# EAGLE design Finishline Controller (EAGLE 7.7.0)
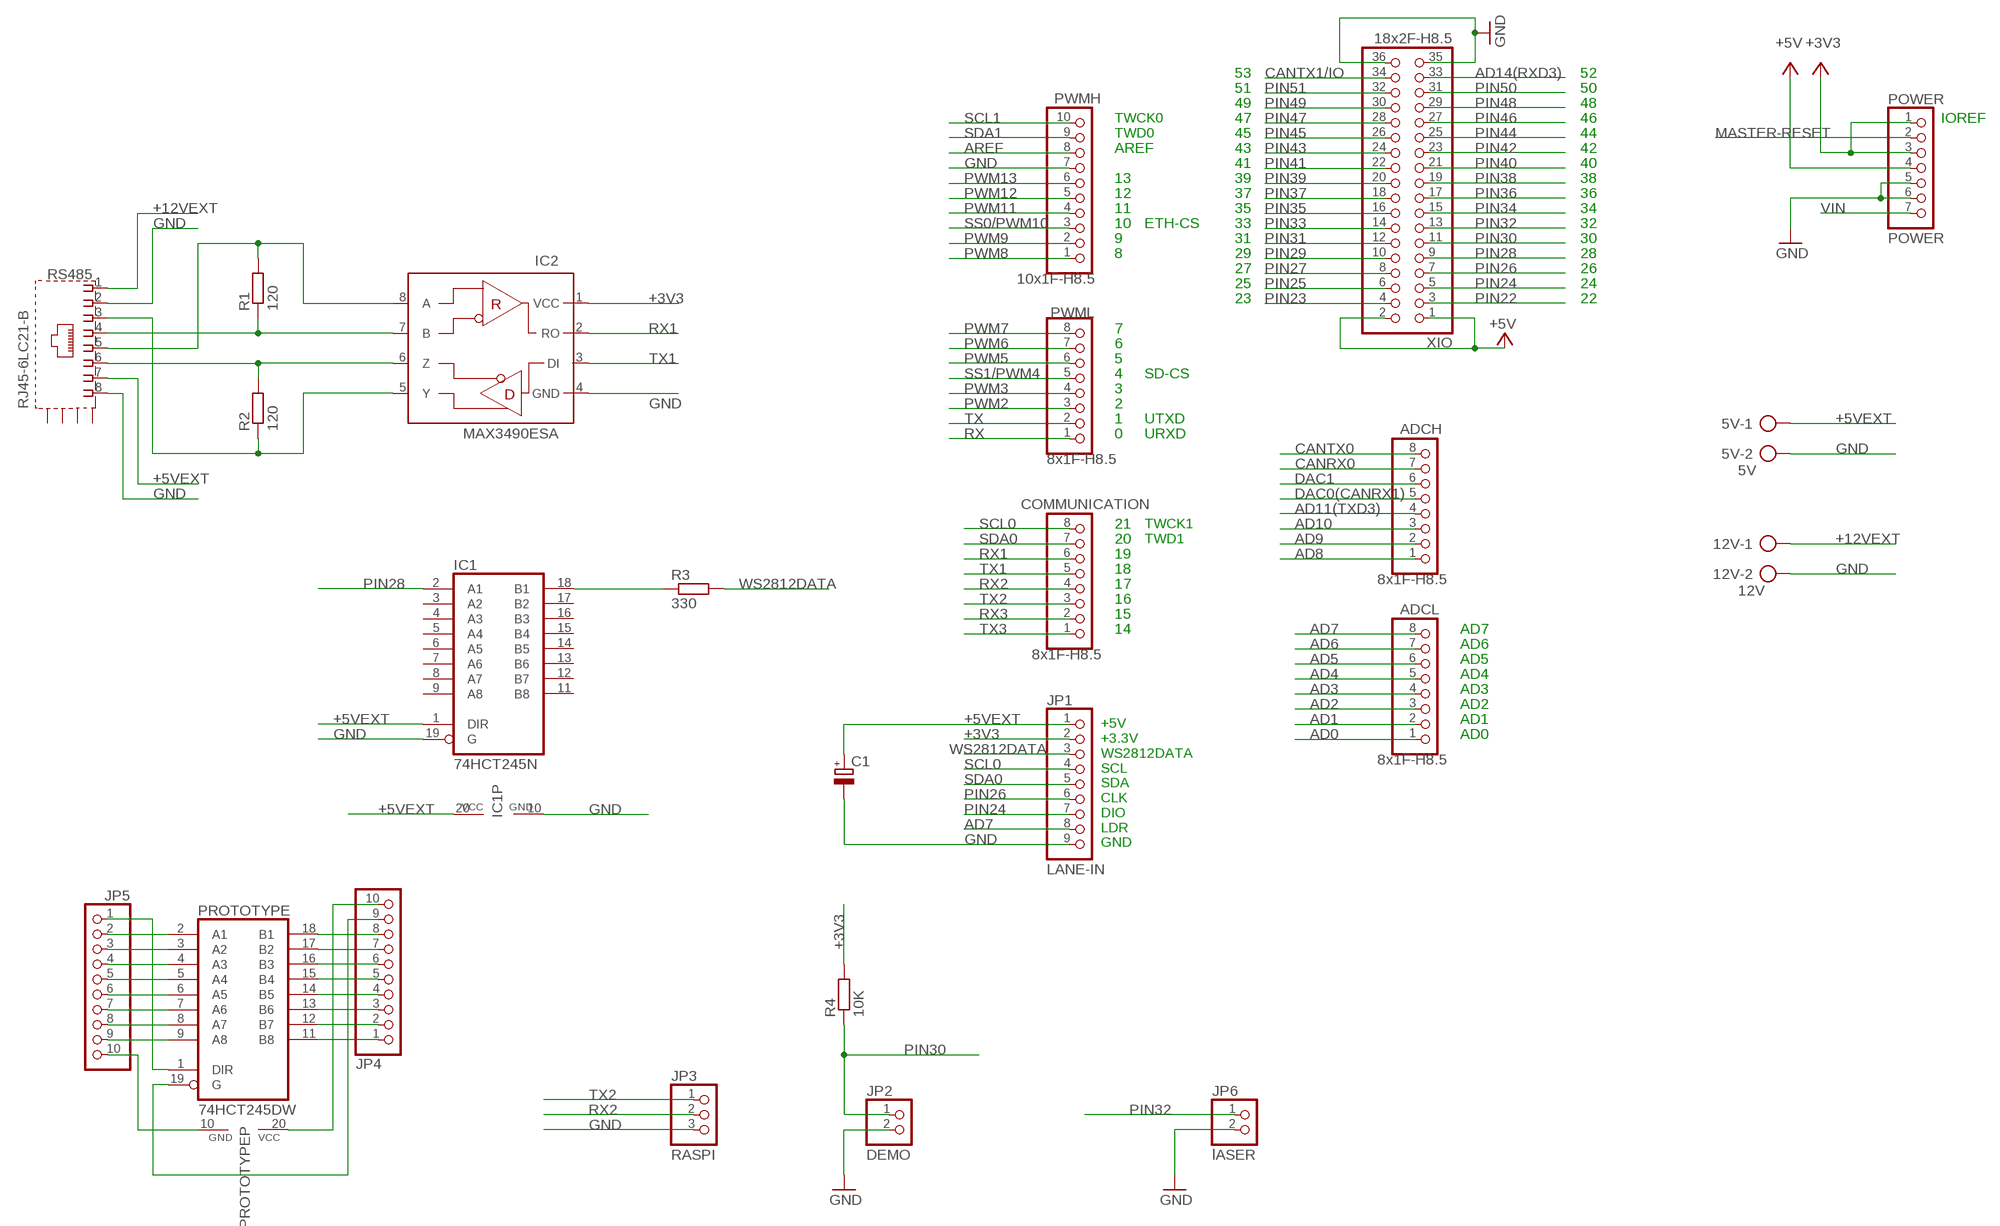
[diagram p0: schematic, sheet 1]

## Parts
5V  5V  AK300/2  [AK300/2]
12V  12V  AK300/2  [AK300/2]
ADCH  8x1F-H8.5  PINHD-1X8  [1X08]
ADCL  8x1F-H8.5  PINHD-1X8  [1X08]
C1  CPOL-EUE5-10.5  [E5-10,5]
COMMUNICATION  8x1F-H8.5  PINHD-1X8  [1X08]
IC1  74HCT245N  [DIL20]
IC2  MAX3490ESA  [SO08]
JP1  LANE-IN  PINHD-1X9  [1X09]
JP2  DEMO  PINHD-1X2  [1X02]
JP3  RASPI  PINHD-1X3  [1X03]
JP4  PINHD-1X10  [1X10]
JP5  PINHD-1X10  [1X10]
JP6  lASER  PINHD-1X2  [1X02]
POWER  POWER  PINHD-1X7  [1X07]
PROTOTYPE  74HCT245DW  [SO20W]
PWMH  10x1F-H8.5  PINHD-1X10  [1X10]
PWML  8x1F-H8.5  PINHD-1X8  [1X08]
R1  120  R-EU_R0805  [R0805]
R2  120  R-EU_R0805  [R0805]
R3  330  R-EU_R0805  [R0805]
R4  10K  R-EU_R0805  [R0805]
RS485  RJ45-6LC21-B  [RJ45-SHIELD1]
XIO  18x2F-H8.5  PINHD-2X18  [2X18]

## Nets
+3V3: IC2.1(VCC) JP1.2 POWER.1 POWER.3 R4.2
+5V: POWER.4 XIO.1 XIO.2
+5VEXT: 5V.1 C1.+ IC1.1(DIR) IC1.20(VCC) JP1.1 RS485.7
+12VEXT [12V]: 12V.1 RS485.1
AD0: ADCL.1
AD1: ADCL.2
AD2: ADCL.3
AD3: ADCL.4
AD4: ADCL.5
AD5: ADCL.6
AD6: ADCL.7
AD7: ADCL.8 JP1.8
AD8: ADCH.1
AD9: ADCH.2
AD10: ADCH.3
AD11(TXD3): ADCH.4
AD14(RXD3): XIO.33
AREF: PWMH.8
CANRX0: ADCH.7
CANTX0: ADCH.8
CANTX1/IO: XIO.34
DAC0(CANRX1): ADCH.5
DAC1: ADCH.6
GND: 5V.2 12V.2 C1.- IC1.10(GND) IC1.19(G) IC2.4(GND) JP1.9 JP2.2 JP3.3 JP6.2 POWER.5 POWER.6 PWMH.7 RS485.2 RS485.8 XIO.35 XIO.36
MASTER-RESET: POWER.2
N$2: IC1.18(B1) R3.1
N$3: IC2.7(B) R1.1 RS485.4
N$4: IC2.6(Z) R2.2 RS485.6
N$5: IC2.5(Y) R2.1 RS485.3
N$6: IC2.8(A) R1.2 RS485.5
N$79: JP5.2 PROTOTYPE.2(A1)
N$80: JP5.3 PROTOTYPE.3(A2)
N$81: JP5.4 PROTOTYPE.4(A3)
N$82: JP5.5 PROTOTYPE.5(A4)
N$83: JP5.6 PROTOTYPE.6(A5)
N$84: JP5.7 PROTOTYPE.7(A6)
N$85: JP5.8 PROTOTYPE.8(A7)
N$86: JP5.9 PROTOTYPE.9(A8)
N$87: JP5.10 PROTOTYPE.10(GND)
N$88: JP5.1 PROTOTYPE.1(DIR)
N$89: JP4.8 PROTOTYPE.18(B1)
N$90: JP4.7 PROTOTYPE.17(B2)
N$91: JP4.6 PROTOTYPE.16(B3)
N$92: JP4.5 PROTOTYPE.15(B4)
N$93: JP4.4 PROTOTYPE.14(B5)
N$94: JP4.3 PROTOTYPE.13(B6)
N$95: JP4.2 PROTOTYPE.12(B7)
N$96: JP4.1 PROTOTYPE.11(B8)
N$97: JP4.9 PROTOTYPE.19(G)
N$98: JP4.10 PROTOTYPE.20(VCC)
PIN22: XIO.3
PIN23: XIO.4
PIN24: JP1.7 XIO.5
PIN25: XIO.6
PIN26: JP1.6 XIO.7
PIN27: XIO.8
PIN28: IC1.2(A1) XIO.9
PIN29: XIO.10
PIN30: JP2.1 R4.1 XIO.11
PIN31: XIO.12
PIN32: JP6.1 XIO.13
PIN33: XIO.14
PIN34: XIO.15
PIN35: XIO.16
PIN36: XIO.17
PIN37: XIO.18
PIN38: XIO.19
PIN39: XIO.20
PIN40: XIO.21
PIN41: XIO.22
PIN42: XIO.23
PIN43: XIO.24
PIN44: XIO.25
PIN45: XIO.26
PIN46: XIO.27
PIN47: XIO.28
PIN48: XIO.29
PIN49: XIO.30
PIN50: XIO.31
PIN51: XIO.32
PWM2: PWML.3
PWM3: PWML.4
PWM5: PWML.6
PWM6: PWML.7
PWM7: PWML.8
PWM8: PWMH.1
PWM9: PWMH.2
PWM11: PWMH.4
PWM12: PWMH.5
PWM13: PWMH.6
RX: PWML.1
RX1: COMMUNICATION.6 IC2.2(RO)
RX2: COMMUNICATION.4 JP3.2
RX3: COMMUNICATION.2
SCL0: COMMUNICATION.8 JP1.4
SCL1: PWMH.10
SDA0: COMMUNICATION.7 JP1.5
SDA1: PWMH.9
SS0/PWM10: PWMH.3
SS1/PWM4: PWML.5
TX: PWML.2
TX1: COMMUNICATION.5 IC2.3(DI)
TX2: COMMUNICATION.3 JP3.1
TX3: COMMUNICATION.1
VIN: POWER.7
WS2812DATA: JP1.3 R3.2
Unconnected: IC1.3(A2) IC1.4(A3) IC1.5(A4) IC1.6(A5) IC1.7(A6) IC1.8(A7) IC1.9(A8) IC1.11(B8) IC1.12(B7) IC1.13(B6) IC1.14(B5) IC1.15(B4) IC1.16(B3) IC1.17(B2) RS485.S1(S) RS485.S2(S) RS485.S3(S) RS485.S4(S)

## Notes on the sheet
- 53 | 52
- 51 | 50
- 49 | 48
- TWCK0 | 47 | 46 | IOREF
- TWD0 | 45 | 44
- AREF | 43 | 42
- 41 | 40
- 13 | 39 | 38
- 12 | 37 | 36
- 11 | 35 | 34
- 10 | ETH-CS | 33 | 32
- 9 | 31 | 30
- 8 | 29 | 28
- 27 | 26
- 25 | 24
- 23 | 22
- 7
- 6
- 5
- 4 | SD-CS
- 3
- 2
- 1 | UTXD
- 0 | URXD
- 21 | TWCK1
- 20 | TWD1
- 19
- 18
- 17
- 16
- 15
- 14 | AD7
- AD6
- AD5
- AD4
- AD3
- AD2
- AD1
- AD0
- +5V
  +3.3V
  WS2812DATA
  SCL
  SDA
  CLK
  DIO
  LDR
  GND

## Library data of the parts
5V 12V = con-ptr500:AK300/2: CONNECTOR; OC_FARNELL: unknown; OC_NEWARK: unknown
ADCH ADCL COMMUNICATION PWML = SmartPrj:PINHD-1X8: PIN HEADER
C1 = resistor:CPOL-EU: POLARIZED CAPACITOR, European symbol
IC1 PROTOTYPE = 74xx-eu:74*245: Octal BUS TRANSCEIVER, 3-state
IC2 = miro:MAX3490: +3.3V 10Mbps, RS-485 Transceivers
JP1 = pinhead:PINHD-1X9: PIN HEADER
JP2 JP6 = pinhead:PINHD-1X2: PIN HEADER
JP3 = pinhead:PINHD-1X3: PIN HEADER
JP4 JP5 = pinhead:PINHD-1X10: PIN HEADER
POWER = pinhead:PINHD-1X7: PIN HEADER
PWMH = SmartPrj:PINHD-1X10: PIN HEADER
R1-R4 = resistor:R-EU_: RESISTOR, European symbol
RS485 = con-tycoelectronics:RJ45*2: RJ45 Low Profile Shield Type 2 For all RJ45 L, LC, LCT and X Series Models Source: www.tycoelectronics.com .. ENG_DS_1654001_1099_RJ_L_0507.pdf; OC_FARNELL: unknown; OC_NEWARK: unknown
XIO = SmartPrj:PINHD-2X18: PIN HEADER

## Net classes
1 USB: width 0.203 mm, drill 0.406 mm, clearance 0.203 mm
2 gnd: width 0.203 mm, drill 0.406 mm, clearance 0.203 mm
3 usbvcc: width 0.203 mm, drill 0.406 mm, clearance 0.203 mm
4 USBpair: width 0.254 mm, drill 0.406 mm, clearance 0.61 mm
5 12V: width 0.305 mm, drill 0.406 mm, clearance 0.61 mm

## Board
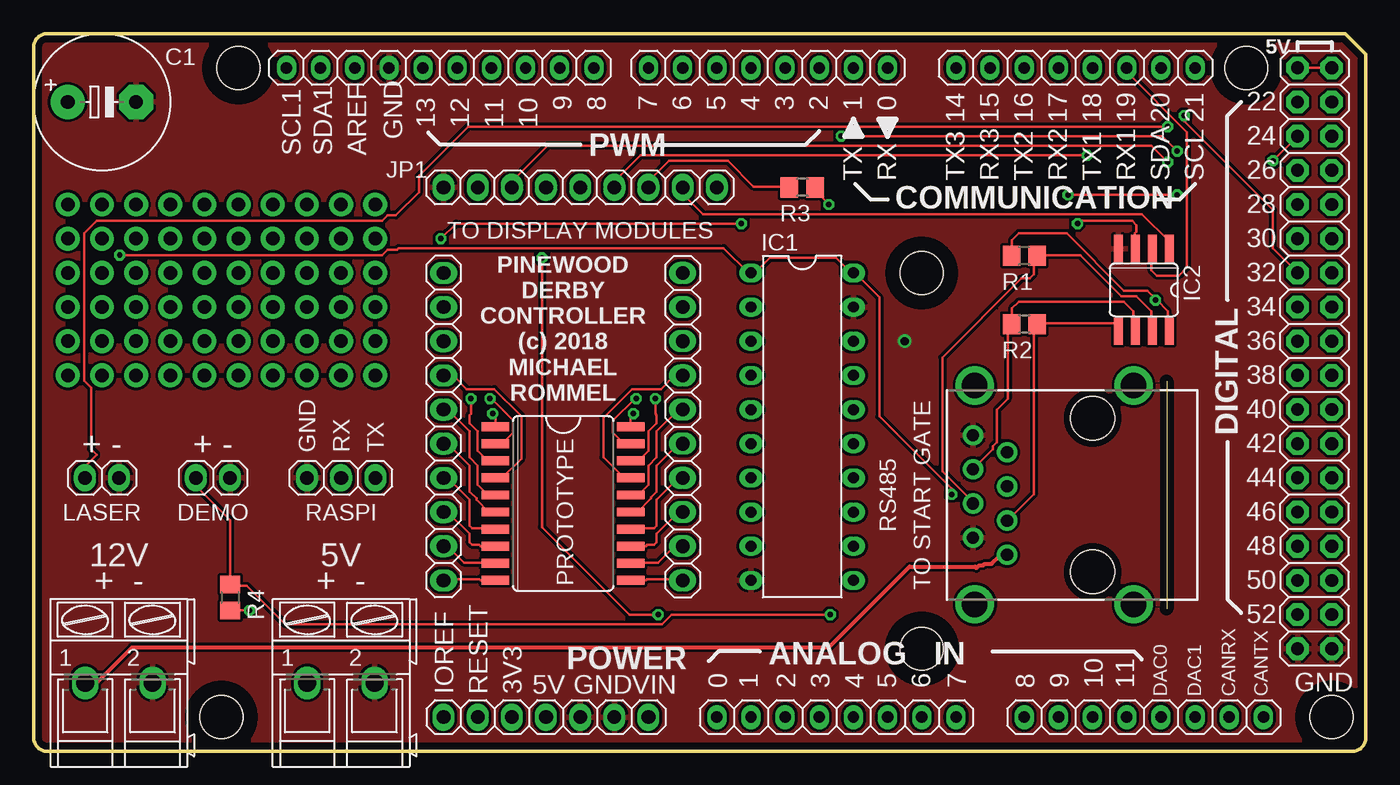
[diagram p1: board, top side]
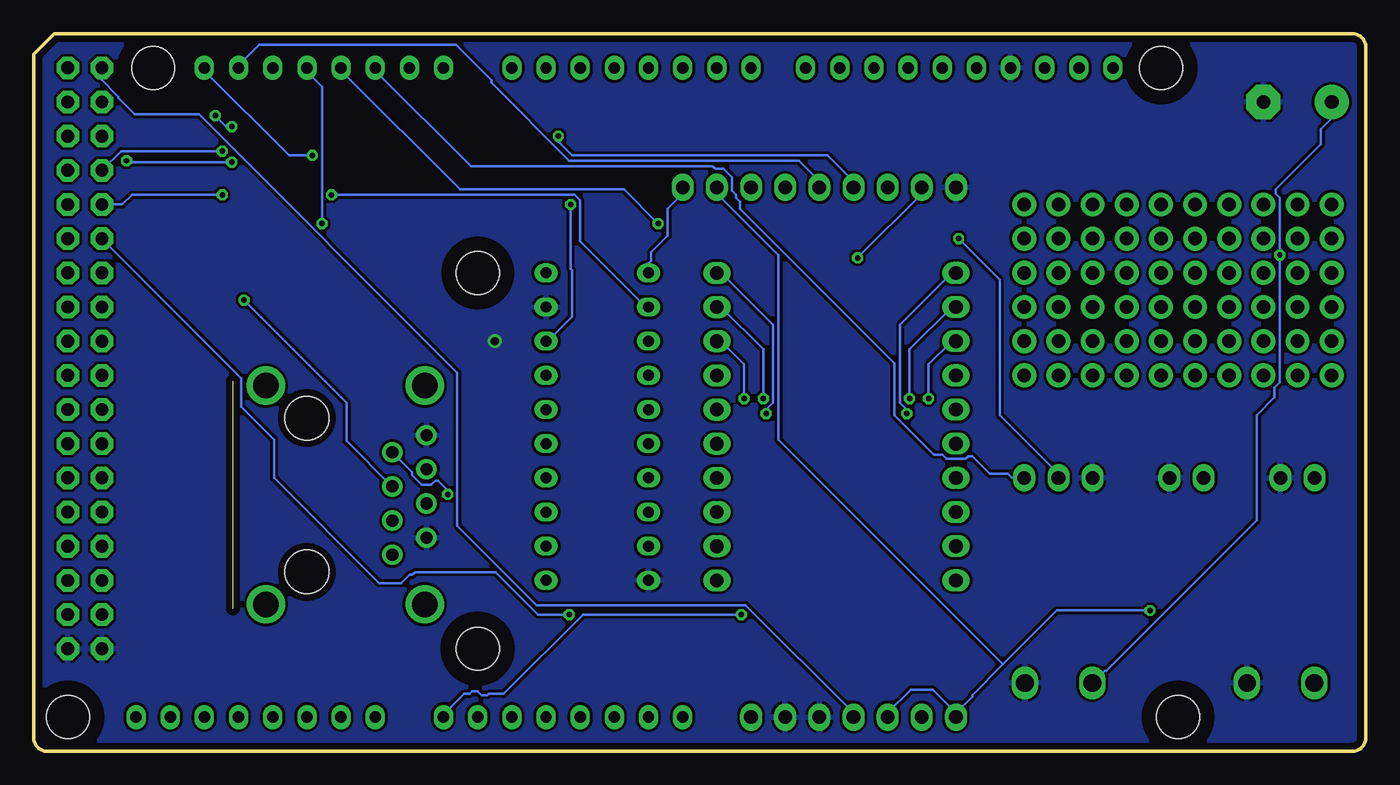
[diagram p2: board, bottom side, seen from below]

Size 99.06 x 53.34 mm. Coordinates in mm from the lower left corner, seen from the top.
Outline: 97.54,53.34 99.06,51.82 99.06,1 arc-90 98.06,0 1,0 arc-90 0,1 0,52.34 arc-90 1,53.34 97.54,53.34
Copper layers (1*16): Top 0.035mm / dielectric 1.6mm / Bottom 0.035mm
Design rules "default *": minimum track width 8mil, minimum drill 16mil, track to track 8mil, track to pad 8mil, pad to pad 8mil, via to via 8mil, smd to smd 6mil, copper to edge 20mil, drill to drill 12mil, minimum pad ring 12mil, minimum via ring 8mil, stop-mask expansion 2mil, vias tented up to drill 25mil, thermal gap 8mil
Holes 3.2 mm at 96.52,2.54 15.24,50.8 90.17,50.8 13.97,2.54 66.04,35.56 66.04,7.62
tRestrict: area 63.5,5.1 to 68.6,10.2; area 12.7,48.3 to 17.8,53.3; area 63.5,33 to 68.6,38.1; area 87.6,48.3 to 92.7,53.3; area 94,0 to 99.1,5.1; area 11.4,0 to 16.5,5.1
bRestrict: area 63.5,5.1 to 68.6,10.2; area 12.7,48.3 to 17.8,53.3; area 63.5,33 to 68.6,38.1; area 87.6,48.3 to 92.7,53.3; area 94,0 to 99.1,5.1; area 11.4,0 to 16.5,5.1

### Footprints (pad centres in the part's own frame; a part is rotated, then mirrored left to right if it is on the bottom)
AK300/2 = drill 1.321 long: 1 -2.515,0; 2 2.489,0
1X08 = drill 0.85 pad 1.422 long: 1 -8.89,0; 2 -6.35,0; 3 -3.81,0; 4 -1.27,0; 5 1.27,0; 6 3.81,0; 7 6.35,0; 8 8.89,0
E5-10,5 = drill 1.016 pad 2.54: + -2.54,0 | drill 1.016 pad 2.54 octagon: - 2.54,0
DIL20 = drill 0.813 long: 1 -11.43,-3.81; 2 -8.89,-3.81; 3 -6.35,-3.81; 4 -3.81,-3.81; 5 -1.27,-3.81; 6 1.27,-3.81; 7 3.81,-3.81; 8 6.35,-3.81; 9 8.89,-3.81; 10 11.43,-3.81; 11 11.43,3.81; 12 8.89,3.81; 13 6.35,3.81; 14 3.81,3.81; 15 1.27,3.81; 16 -1.27,3.81; 17 -3.81,3.81; 18 -6.35,3.81; 19 -8.89,3.81; 20 -11.43,3.81
SO08 = smd 0.66 x 2.032: 1 -1.905,-3.073; 2 -0.635,-3.073; 3 0.635,-3.073; 4 1.905,-3.073; 5 1.905,3.073; 6 0.635,3.073; 7 -0.635,3.073; 8 -1.905,3.073
1X09 = drill 1.016 long: 1 -10.16,0; 2 -7.62,0; 3 -5.08,0; 4 -2.54,0; 5 0,0; 6 2.54,0; 7 5.08,0; 8 7.62,0; 9 10.16,0
1X02 = drill 1.016 long: 1 -1.27,0; 2 1.27,0
1X03 = drill 1.016 long: 1 -2.54,0; 2 0,0; 3 2.54,0
1X10 = drill 1.016 long: 1 -11.43,0; 2 -8.89,0; 3 -6.35,0; 4 -3.81,0; 5 -1.27,0; 6 1.27,0; 7 3.81,0; 8 6.35,0; 9 8.89,0; 10 11.43,0
1X07 = drill 1.016 long: 1 -7.62,0; 2 -5.08,0; 3 -2.54,0; 4 0,0; 5 2.54,0; 6 5.08,0; 7 7.62,0
SO20W = smd 0.66 x 2.032: 1 -5.715,-5.029; 2 -4.445,-5.029; 3 -3.175,-5.029; 4 -1.905,-5.029; 5 -0.635,-5.029; 6 0.635,-5.029; 7 1.905,-5.029; 8 3.175,-5.029; 9 4.445,-5.029; 10 5.715,-5.029; 11 5.715,5.029; 12 4.445,5.029; 13 3.175,5.029; 14 1.905,5.029; 15 0.635,5.029; 16 -0.635,5.029; 17 -1.905,5.029; 18 -3.175,5.029; 19 -4.445,5.029; 20 -5.715,5.029
1X10' = drill 0.85 pad 1.422 long: 1 -11.43,0; 2 -8.89,0; 3 -6.35,0; 4 -3.81,0; 5 -1.27,0; 6 1.27,0; 7 3.81,0; 8 6.35,0; 9 8.89,0; 10 11.43,0
R0805 = smd 1.3 x 1.5: 1 -0.95,0; 2 0.95,0
RJ45-SHIELD1 = drill 0.9 pad 1.4: 1 -4.445,6.35; 2 -3.175,8.89; 3 -1.905,6.35; 4 -0.635,8.89; 5 0.635,6.35; 6 1.905,8.89; 7 3.175,6.35; 8 4.445,8.89 | drill 1.9 pad 2.5: S1 -8.128,-3.048; S2 8.128,-3.048; S3 -8.128,8.76; S4 8.128,8.76 | hole 3.251: -5.715,0; 5.715,0
2X18 = drill 0.95 pad 1.676 octagon: 1 -21.59,-1.27; 2 -21.59,1.27; 3 -19.05,-1.27; 4 -19.05,1.27; 5 -16.51,-1.27; 6 -16.51,1.27; 7 -13.97,-1.27; 8 -13.97,1.27; 9 -11.43,-1.27; 10 -11.43,1.27; 11 -8.89,-1.27; 12 -8.89,1.27; 13 -6.35,-1.27; 14 -6.35,1.27; 15 -3.81,-1.27; 16 -3.81,1.27; 17 -1.27,-1.27; 18 -1.27,1.27; 19 1.27,-1.27; 20 1.27,1.27; 21 3.81,-1.27; 22 3.81,1.27; 23 6.35,-1.27; 24 6.35,1.27; 25 8.89,-1.27; 26 8.89,1.27; 27 11.43,-1.27; 28 11.43,1.27; 29 13.97,-1.27; 30 13.97,1.27; 31 16.51,-1.27; 32 16.51,1.27; 33 19.05,-1.27; 34 19.05,1.27; 35 21.59,-1.27; 36 21.59,1.27

### Placement (x,y rotation side)
5V  22.86,5.08 0 top
12V  6.35,5.08 0 top
ADCH  82.55,2.54 0 top
ADCL  59.69,2.54 0 top
C1  5.08,48.26 0 top
COMMUNICATION  77.47,50.8 0 top
IC1  57.15,24.13 270 top
IC2  82.55,34.29 180 top
JP1  40.64,41.91 180 top
JP2  13.34,20.32 0 top
JP3  22.86,20.32 180 top
JP4  48.26,24.13 90 top
JP5  30.48,24.13 270 top
JP6  5.08,20.32 0 top
POWER  38.1,2.54 0 top
PROTOTYPE  39.37,18.41 270 top
PWMH  10x1F-H8.5  [1X10']  30.23,50.8 180 top
PWML  54.61,50.8 180 top
R1  73.66,36.83 180 top
R2  73.66,31.75 180 top
R3  57.15,41.91 180 top
R4  14.61,11.43 270 top
RS485  78.74,19.05 90 top
XIO  95.25,29.21 270 top

### Tracks (layer width: path | path; a pad name or v marks a point on that pad's centre or on a via)
+3V3  (via drill 0.41)
  Top 0.203: v16.05,10.46 14.63,10.46 R4.2 | JP1.2 48.26,41.45 49.78,39.93 82.4,39.93 84.43,37.9 84.43,37.39 IC2.1
  Bottom 0.203: v16.05,10.46 22.96,10.46 26.98,6.45 | 26.98,6.45 29.26,4.17 29.26,4.06 30.48,2.85 | POWER.3 35.56,2.85 33.83,4.57 32.21,4.57 30.48,2.85 | 30.48,2.85 POWER.1 | 26.98,6.45 43.69,23.16 43.69,36.88 48.26,41.45 JP1.2
+5V
  Top 0.203: XIO.1 XIO.2
  Bottom 0.203: POWER.4 38.1,2.85 46.13,10.87 61.67,10.87 67.56,16.76 67.56,28.14 86.77,47.35 91.54,47.35 92.76,48.56 92.76,48.67 94.08,49.99 94.08,50.7 XIO.1
+5VEXT  (via drill 0.41)
  Top 0.203: v68.28,19.1 68.28,19.51 62.89,24.89 62.89,33.73 61.06,35.56 IC1.20 60.76,35.56 59.64,36.68 54.76,36.68 53.65,35.56 IC1.1 53.14,35.56 51.31,37.39 27.13,37.39 27.03,37.29 26.31,37.29 25.91,36.88 v6.4,36.88
  Bottom 0.203: IC1.1 53.34,36.27 53.14,36.47 53.14,37.08 51.92,38.3 51.92,40.34 50.8,41.45 JP1.1 | v68.28,19.1 68.28,19.41 68.99,20.12 69.19,20.12 69.49,19.81 70.21,19.81 70.92,20.52 70.92,20.73 72.34,22.15 RS485.7 | C1.+ 2.54,47.04 3.35,46.23 3.35,45.11 6.71,41.76 6.71,41.45 6.4,41.15 v6.4,36.88 6.4,27.43 6.81,27.03 6.81,26.31 8.13,24.99 8.13,17.17 19.3,5.99 19.41,5.99 20.32,5.08 5V.1
+12VEXT
  Top 0.305: 12V.1 4.67,5.08 7.32,7.72 59.13,7.72 65.13,13.72 70,13.72 70.1,13.61 70.31,13.82 70.61,13.82 70.71,13.92 71.22,13.92 71.83,14.53 72.34,14.53 RS485.1
AD7  (via drill 0.41)
  Top 0.203: v46.43,10.16 44.3,10.16 37.8,16.66 v37.8,36.68
  Bottom 0.203: ADCL.8 68.58,2.74 67.06,4.27 66.65,4.27 66.45,4.47 66.04,4.47 65.73,4.17 65.33,4.17 65.23,4.27 64.11,4.27 58.22,10.16 v46.43,10.16 | v37.8,36.68 33.02,41.45 JP1.8
GND  (via drill 0.6)
  other vias: 64.77,30.48
  pour Bottom: -1.27,54.61 100.33,54.61 100.33,-1.27 -1.27,-1.27
  pour Top: -1.27,54.61 100.33,54.61 100.33,-1.27 -1.27,-1.27
N$1  (via drill 1 pad 1.78)
  other vias: 17.78,27.94
N$2  (via drill 0.41)
  Top 0.203: v59.13,40.64 58.12,41.66 58.12,41.86 R3.1
  Bottom 0.203: v59.13,40.64 59.13,35.87 59.03,35.76 59.03,32.31 60.86,30.48 IC1.18
N$3
  Top 0.203: IC2.7 83.11,31.29 83.11,32.72 81.99,33.83 80.87,33.83 77.83,36.88 74.68,36.88 R1.1 74.57,36.78 74.37,36.58 74.37,35.46 74.07,35.15 73.46,35.15 67.56,29.26 67.56,20.83 69.49,18.9 69.49,18.8 69.8,18.49 RS485.4
N$4
  Top 0.203: IC2.6 81.99,31.29 81.99,32.21 81.79,32.41 81.79,32.72 81.08,33.43 73.25,33.43 72.75,32.92 72.75,31.8 R2.2 72.64,31.7 72.44,31.5 72.44,26.21 71.63,25.4 71.63,22.96 71.32,22.66 71.32,22.45 69.9,21.03 RS485.6
N$5
  Top 0.203: IC2.5 80.57,31.29 80.57,31.6 80.37,31.8 74.68,31.8 R2.1 74.57,31.7 74.37,31.5 74.37,19.1 72.44,17.17 RS485.3
N$6  (via drill 0.41)
  Top 0.203: 83.46,33.58 84.33,32.72 84.33,32.41 84.53,32.21 84.53,31.29 IC2.8 | 83.46,33.58 82.8,34.24 81.08,34.24 76.81,38.51 73.25,38.51 72.75,38 72.75,36.88 R1.2 | v83.41,33.53 83.46,33.58
  Bottom 0.203: v83.41,33.53 75.79,25.91 75.79,23.06 72.44,19.71 RS485.5
N$7  (via drill 1 pad 1.78)
  other vias: 15.24,27.94
N$8  (via drill 1 pad 1.78)
  other vias: 12.7,27.94
N$9  (via drill 1 pad 1.78)
  other vias: 10.16,27.94
N$10  (via drill 1 pad 1.78)
  other vias: 7.62,27.94
N$11  (via drill 1 pad 1.78)
  other vias: 5.08,27.94
N$12  (via drill 1 pad 1.78)
  other vias: 2.54,27.94
N$13  (via drill 1 pad 1.78)
  other vias: 25.4,27.94
N$14  (via drill 1 pad 1.78)
  other vias: 22.86,27.94
N$15  (via drill 1 pad 1.78)
  other vias: 20.32,27.94
N$31  (via drill 1 pad 1.78)
  other vias: 5.08,40.64
N$32  (via drill 1 pad 1.78)
  other vias: 7.62,40.64
N$33  (via drill 1 pad 1.78)
  other vias: 10.16,40.64
N$34  (via drill 1 pad 1.78)
  other vias: 12.7,40.64
N$35  (via drill 1 pad 1.78)
  other vias: 15.24,40.64
N$36  (via drill 1 pad 1.78)
  other vias: 17.78,40.64
N$41  (via drill 1 pad 1.78)
  other vias: 17.78,38.1
N$42  (via drill 1 pad 1.78)
  other vias: 15.24,38.1
N$43  (via drill 1 pad 1.78)
  other vias: 12.7,38.1
N$44  (via drill 1 pad 1.78)
  other vias: 10.16,38.1
N$46  (via drill 1 pad 1.78)
  other vias: 5.08,38.1
N$47  (via drill 1 pad 1.78)
  other vias: 7.62,38.1
N$48  (via drill 1 pad 1.78)
  other vias: 7.62,33.02
N$49  (via drill 1 pad 1.78)
  other vias: 10.16,33.02
N$50  (via drill 1 pad 1.78)
  other vias: 12.7,33.02
N$51  (via drill 1 pad 1.78)
  other vias: 15.24,33.02
N$52  (via drill 1 pad 1.78)
  other vias: 17.78,33.02
N$53  (via drill 1 pad 1.78)
  other vias: 20.32,40.64
N$54  (via drill 1 pad 1.78)
  other vias: 22.86,40.64
N$55  (via drill 1 pad 1.78)
  other vias: 25.4,40.64
N$58  (via drill 1 pad 1.78)
  other vias: 5.08,35.56
N$59  (via drill 1 pad 1.78)
  other vias: 7.62,35.56
N$60  (via drill 1 pad 1.78)
  other vias: 10.16,35.56
N$61  (via drill 1 pad 1.78)
  other vias: 12.7,35.56
N$62  (via drill 1 pad 1.78)
  other vias: 15.24,35.56
N$63  (via drill 1 pad 1.78)
  other vias: 17.78,35.56
N$64  (via drill 1 pad 1.78)
  other vias: 25.4,38.1
N$65  (via drill 1 pad 1.78)
  other vias: 22.86,38.1
N$66  (via drill 1 pad 1.78)
  other vias: 20.32,38.1
N$67  (via drill 1 pad 1.78)
  other vias: 20.32,35.56
N$68  (via drill 1 pad 1.78)
  other vias: 22.86,35.56
N$69  (via drill 1 pad 1.78)
  other vias: 25.4,35.56
N$70  (via drill 1 pad 1.78)
  other vias: 17.78,30.48
N$71  (via drill 1 pad 1.78)
  other vias: 15.24,30.48
N$72  (via drill 1 pad 1.78)
  other vias: 12.7,30.48
N$73  (via drill 1 pad 1.78)
  other vias: 10.16,30.48
N$74  (via drill 1 pad 1.78)
  other vias: 7.62,30.48
N$75  (via drill 1 pad 1.78)
  other vias: 5.08,30.48
N$76  (via drill 1 pad 1.78)
  other vias: 5.08,33.02
N$78  (via drill 1 pad 1.78)
  other vias: 20.32,33.02
N$79  (via drill 0.41)
  Top 0.203: PROTOTYPE.2 34.85,22.86 35.66,23.67 35.66,24.59 34.04,26.21 v33.93,26.21
  Bottom 0.203: v33.93,26.21 33.93,29.87 30.79,33.02 JP5.2
N$80  (via drill 0.41)
  Top 0.203: v32.51,26.21 32.51,25.09 32.41,24.99 32.41,24.38 33.02,23.77 33.02,22.35 33.73,21.64 34.34,21.64 PROTOTYPE.3
  Bottom 0.203: v32.51,26.21 32.51,28.75 30.79,30.48 JP5.3
N$81
  Top 0.203: PROTOTYPE.4 34.85,20.32 36.27,21.74 36.27,24.89 34.24,26.92 32.21,26.92 31.19,27.94 JP5.4
N$82
  Top 0.203: JP5.5 30.79,25.4 32.41,23.77 32.41,21.84 33.02,21.23 33.02,19.81 33.73,19.1 34.34,19.1 PROTOTYPE.5
N$83
  Top 0.203: PROTOTYPE.6 33.83,17.78 32.92,18.69 32.92,18.8 32.41,19.3 32.41,21.23 30.79,22.86 JP5.6
N$84
  Top 0.203: JP5.7 30.79,20.32 32.41,18.69 32.41,16.76 32.61,16.56 34.34,16.56 PROTOTYPE.7
N$85
  Top 0.203: PROTOTYPE.8 33.22,15.24 33.12,15.34 32.61,15.34 32.41,15.54 32.41,16.15 30.79,17.78 JP5.8
N$86
  Top 0.203: JP5.9 30.79,15.24 32,14.02 34.34,14.02 PROTOTYPE.9
N$87
  Top 0.203: PROTOTYPE.10 33.22,12.7 33.12,12.8 30.58,12.8 JP5.10
N$88  (via drill 0.41)
  Top 0.203: PROTOTYPE.1 34.34,24.89 v34.14,25.09
  Bottom 0.203: v34.14,25.09 34.14,25.4 34.65,25.91 34.65,31.7 30.79,35.56 JP5.1
N$89  (via drill 0.41)
  Top 0.203: v46.23,26.21 46.23,25.09 46.33,24.99 46.33,24.38 45.72,23.77 45.72,22.35 45.01,21.64 44.4,21.64 PROTOTYPE.18
  Bottom 0.203: v46.23,26.21 46.23,28.75 47.95,30.48 JP4.8
N$90
  Top 0.203: PROTOTYPE.17 43.89,20.32 42.37,21.84 42.37,24.79 44.5,26.92 46.63,26.92 47.65,27.94 JP4.7
N$91
  Top 0.203: JP4.6 47.95,25.4 46.33,23.77 46.33,21.84 45.72,21.23 45.72,19.81 45.01,19.1 44.4,19.1 PROTOTYPE.16
N$92
  Top 0.203: PROTOTYPE.15 44.91,17.78 45.92,18.8 45.92,18.9 46.33,19.3 46.33,21.23 47.95,22.86 JP4.5
N$93
  Top 0.203: JP4.4 47.95,20.32 46.33,18.69 46.33,16.76 46.13,16.56 44.4,16.56 PROTOTYPE.14
N$94
  Top 0.203: PROTOTYPE.13 45.52,15.24 45.62,15.34 46.13,15.34 46.33,15.54 46.33,16.15 47.95,17.78 JP4.3
N$95
  Top 0.203: JP4.2 47.65,15.24 46.43,14.02 44.4,14.02 PROTOTYPE.12
N$96
  Top 0.203: PROTOTYPE.11 45.52,12.7 45.62,12.8 48.16,12.8 JP4.1
N$97  (via drill 0.41)
  Top 0.203: PROTOTYPE.19 43.89,22.86 43.08,23.67 43.08,24.59 44.7,26.21 v44.81,26.21
  Bottom 0.203: v44.81,26.21 44.81,29.87 47.95,33.02 JP4.9
N$98  (via drill 0.41)
  Top 0.203: PROTOTYPE.20 44.4,24.89 v44.6,25.09
  Bottom 0.203: v44.6,25.09 44.6,25.4 44.09,25.91 44.09,31.7 47.95,35.56 JP4.10
N$99  (via drill 1 pad 1.78)
  other vias: 22.86,33.02
N$100  (via drill 1 pad 1.78)
  other vias: 25.4,33.02
N$103  (via drill 1 pad 1.78)
  other vias: 25.4,30.48
N$104  (via drill 1 pad 1.78)
  other vias: 22.86,30.48
N$105  (via drill 1 pad 1.78)
  other vias: 20.32,30.48
N$123  (via drill 1 pad 1.78)
  other vias: 2.54,40.64
N$124  (via drill 1 pad 1.78)
  other vias: 2.54,38.1
N$126  (via drill 1 pad 1.78)
  other vias: 2.54,35.56
N$127  (via drill 1 pad 1.78)
  other vias: 2.54,30.48
N$128  (via drill 1 pad 1.78)
  other vias: 2.54,33.02
PIN24  (via drill 0.41)
  Top 0.203: JP1.7 35.56,42.37 38.2,45.01 83.11,45.01 v84.33,43.79 | XIO.5 v92.15,43.89
  Bottom 0.203: v84.33,43.79 92.05,43.79 v92.15,43.89
PIN26  (via drill 0.41)
  Top 0.203: v60.05,45.72 83.92,45.72 v85.04,44.6
  Bottom 0.203: JP1.6 38.1,42.37 40.03,44.3 59.03,44.3 60.05,45.31 v60.05,45.72 | v85.04,44.6 92.56,44.6 XIO.7
PIN28  (via drill 0.41)
  Top 0.203: v85.04,41.35 v76.91,41.35
  Bottom 0.203: IC1.2 53.54,33.02 58.42,37.9 58.42,40.95 58.83,41.35 v76.91,41.35 | v85.04,41.35 91.75,41.35 92.46,40.64 XIO.9
PIN30  (via drill 0.41)
  Top 0.203: JP2.1 12.09,20.32 12.09,19.71 14.63,17.17 14.63,12.39 R4.1 14.63,12.29 15.85,12.29 18.69,9.45 46.74,9.45 47.45,10.16 v59.23,10.16
  Bottom 0.203: XIO.11 83.62,27.74 83.62,25.6 81.18,23.16 81.18,20.32 73.36,12.5 71.73,12.5 71.12,13.11 70.92,13.11 70.71,13.31 64.72,13.31 61.57,10.16 v59.23,10.16
PIN32  (via drill 0.41)
  Top 0.203: v84.33,46.43 32.31,46.43 28.65,42.77 28.65,41.55 26.92,39.83 26.31,39.83 25.91,39.42 4.67,39.42 3.76,38.51 3.76,27.53 4.27,27.03 4.27,22.45 4.67,22.05 3.86,21.23 3.86,20.32 JP6.1 | v85.55,47.24 85.55,46.84 92.15,40.23 92.15,37.39 XIO.13
  Bottom 0.203: v84.33,46.43 84.73,46.43 v85.55,47.24
RX1
  Top 0.203: COMMUNICATION.6 81.28,50.49 85.75,46.02 85.75,35.97 85.14,35.36 83.52,35.36 83.11,35.76 83.11,37.29 IC2.2
RX2  (via drill 0.41)
  Top 0.203: v52.63,39.22 31.39,39.22 v30.28,38.1
  Bottom 0.203: COMMUNICATION.4 76.2,50.6 67.36,41.76 55.17,41.76 v52.63,39.22 | v30.28,38.1 27.23,35.05 27.23,24.99 22.86,20.62 JP3.2
SCL0  (via drill 0.41)
  Top 0.203: v78.33,44.3 45.11,44.3 43.18,42.37 JP1.4
  Bottom 0.203: COMMUNICATION.8 86.36,50.6 80.06,44.3 v78.33,44.3
SDA0
  Bottom 0.203: COMMUNICATION.7 83.82,51 82.3,52.53 67.67,52.53 65.02,49.89 65.02,49.68 59.23,43.89 42.16,43.89 40.64,42.37 JP1.5
TX1  (via drill 0.41)
  Top 0.203: v77.62,39.22 77.83,39.42 81.69,39.42 81.99,39.12 81.99,38.61 81.89,38.51 81.89,37.39 IC2.3
  Bottom 0.203: v77.62,39.22 77.62,49.38 78.74,50.49 COMMUNICATION.5
TX2
  Bottom 0.203: COMMUNICATION.3 73.66,50.6 66.55,43.48 48.56,43.48 48.36,43.28 47.75,43.28 47.14,42.67 47.14,41.66 46.84,41.35 46.84,41.15 46.53,40.84 46.53,40.34 35.05,28.85 35.05,24.99 32.11,22.05 31.5,22.05 31.19,21.74 29.77,21.74 29.57,21.95 29.26,21.95 27.94,20.62 26.62,20.62 26.31,20.32 JP3.1
WS2812DATA
  Top 0.203: JP1.3 45.72,42.37 47.24,43.89 51.61,43.89 53.54,41.96 56.19,41.96 R3.2

### Text on the board
tPlace: 9 | 8 | 7 | 6 | 5 | 4 | 3 | 2 | 1 | 0 | 22 | 14 | 15 | 16 | 17 | 18 | 19 | 20 | 21 | 13 | 12 | 11 | 10 | 24 | 26 | 28 | 30 | 32 | 34 | 36 | 38 | 40 | 42 | 44 | 46 | 48 | 50 | 52 | 0 | 1 | 2 | 3 | 4 | 5 | 6 | 7 | 8 | 9 | 10 | 11 | DAC0 | DAC1 | CANRX | CANTX
tNames: 5V | GND | SCL1 | SDA1 | AREF | PWM | TX | RX | TX3 | RX3 | TX2 | RX2 | TX1 | RX1 | SDA | SCL | TO DISPLAY MODULES | PINEWOOD / DERBY / CONTROLLER / (c) 2018 / MICHAEL / ROMMEL | + - | + - | DIGITAL | GND | RX | TX | TO START GATE | LASER | DEMO | RASPI | + - | + - | ANALOG IN | IOREF | RESET | 3V3 | 5V | GND | VIN | GND